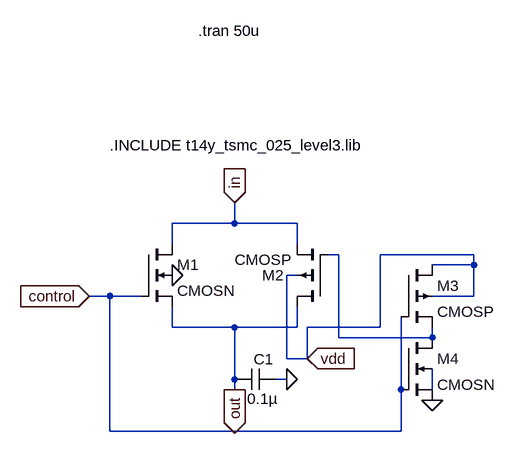
[diagram p0: schematic SH_ckt.asc]
SH_ckt.asc, the LTspice schematic file:
Version 4
SHEET 1 880 680
WIRE 160 -128 160 -160
WIRE 160 -128 64 -128
WIRE 256 -128 160 -128
WIRE 64 -96 64 -128
WIRE 256 -96 256 -128
WIRE 320 -80 304 -80
WIRE 528 -80 384 -80
WIRE 528 -64 528 -80
WIRE 528 -64 464 -64
WIRE 256 -48 240 -48
WIRE -32 -16 -64 -16
WIRE 16 -16 -32 -16
WIRE 528 -16 528 -64
WIRE 528 -16 464 -16
WIRE 64 32 64 0
WIRE 160 32 64 32
WIRE 256 32 256 0
WIRE 256 32 160 32
WIRE 384 32 384 -80
WIRE 384 32 272 32
WIRE 320 48 320 -80
WIRE 464 48 464 32
WIRE 464 48 320 48
WIRE 240 80 240 -48
WIRE 272 80 272 32
WIRE 272 80 240 80
WIRE 160 112 160 32
WIRE 240 112 224 112
WIRE 160 128 160 112
WIRE 416 128 416 16
WIRE 464 128 464 96
WIRE -32 192 -32 -16
WIRE 416 192 416 128
WIRE 416 192 -32 192
FLAG 464 144 0
FLAG 64 -48 0
FLAG 160 128 out
IOPIN 160 128 Out
FLAG -64 -16 control
IOPIN -64 -16 In
FLAG 160 -160 in
IOPIN 160 -160 In
FLAG 272 80 vdd
IOPIN 272 80 In
FLAG 240 112 0
SYMBOL nmos4 16 -96 R0
SYMATTR InstName M1
SYMATTR Value2 l=250n w=20u m=100
SYMATTR Value CMOSN
SYMBOL pmos4 304 0 R180
WINDOW 0 68 48 Left 2
SYMATTR InstName M2
SYMATTR Value2 l=250n w=40u m=100
SYMATTR Value CMOSP
SYMBOL pmos4 416 -64 R0
SYMATTR InstName M3
SYMATTR Value2 l=250n w=40u m=100
SYMATTR Value CMOSP
SYMBOL nmos4 416 48 R0
SYMATTR InstName M4
SYMATTR Value2 l=250n w=20u m=100
SYMATTR Value CMOSN
SYMBOL cap 224 96 R90
WINDOW 0 1 19 VBottom 2
WINDOW 3 30 21 VTop 2
SYMATTR InstName C1
SYMATTR Value 0.1µ
TEXT 104 -424 Left 2 !.tran 50u
TEXT -32 -248 Left 2 !.INCLUDE t14y_tsmc_025_level3.lib

The netlist it stands for:
* SH_ckt.asc
M1 in control out 0 CMOSN l=250n w=20u m=100
M2 out N001 in vdd CMOSP l=250n w=40u m=100
M3 vdd control N001 vdd CMOSP l=250n w=40u m=100
M4 N001 control 0 N002 CMOSN l=250n w=20u m=100
C1 0 out 0.1µ
.model NMOS NMOS
.model PMOS PMOS
.lib standard.mos
.tran 50u
.INCLUDE t14y_tsmc_025_level3.lib
.backanno
.end